# Altium schematic sheet Gastroscopy-CutController_MCU.SchDoc: MCU
size 279 x 215 mm; Date: not used; ApprovedBy: not used; CheckedBy: not used; Author: not used; DrawnBy: not used; Organization: not used; Address4: not used; SheetNumber: 6; SheetTotal: 8; Time: not used; ImagePath: not used; Application_BuildNumber: not used
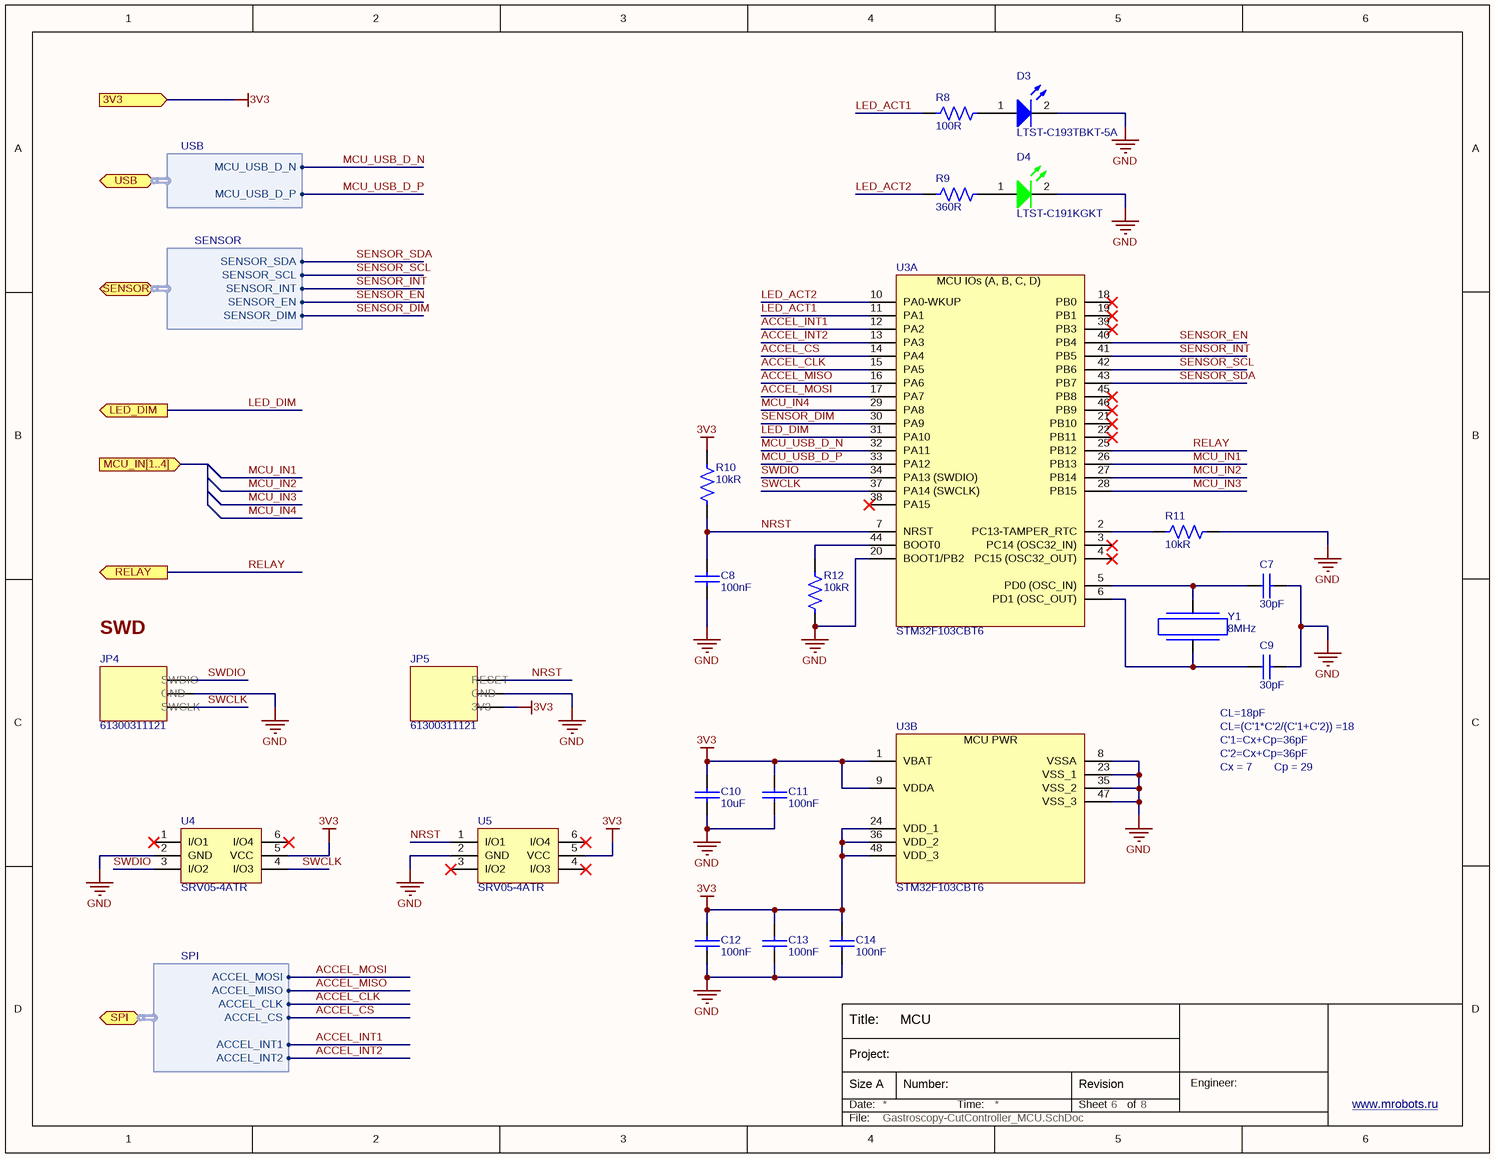
[diagram p0: Gastroscopy-CutController_MCU.SchDoc]

## Parts
C7  30pF  [CAP_0603]
C8  100nF  [CAP_0603]
C9  30pF  [CAP_0603]
C10  10uF  [CAP_0805]
C11  100nF  [CAP_0603]
C12  100nF  [CAP_0603]
C13  100nF  [CAP_0603]
C14  100nF  [CAP_0603]
D3  LTST-C193TBKT-5A  [L_0603_BLUE]
D4  LTST-C191KGKT  [L_0603_GREEN]
JP4  61300311121  [61300311121]
JP5  61300311121  [61300311121]
R8  100R  [RES_0603]
R9  360R  [RES_0603]
R10  10kR  [RES_0603]
R11  10kR  [RES_0603]
R12  10kR  [RES_0603]
U3  STM32F103CBT6  [LQFP48]  (parts A,B of 2)
U4  SRV05-4ATR  [SOT-23-6]
U5  SRV05-4ATR  [SOT-23-6]
Y1  8MHz  [HC-49/US]

## Ports
3V3 (in), LED_DIM (out), MCU_IN[1..4] (in), RELAY (out), SENSOR (bidir, harness SENSOR), SPI (bidir, harness SPI), USB (bidir, harness USB)

## Harnesses
USB: MCU_USB_D_N, MCU_USB_D_P
SENSOR: SENSOR_SDA, SENSOR_SCL, SENSOR_INT, SENSOR_EN, SENSOR_DIM
SPI: ACCEL_MOSI, ACCEL_MISO, ACCEL_CLK, ACCEL_INT1, ACCEL_CS, ACCEL_INT2

## Nets
3V3: C10.2 C11.1 C12.1 C13.1 C14.1 JP5.3 R10.1 U3.1(VBAT) U3.9(VDDA) U3.24(VDD_1) U3.36(VDD_2) U3.48(VDD_3) U4.5(VCC) U5.5(VCC) ; port 3V3
GND: C7.2 C8.2 C9.2 C10.1 C11.2 C12.2 C13.2 C14.2 D3.2(K) D4.2(K) JP4.2 JP5.2 R11.1 R12.1 U3.8(VSSA) U3.20(BOOT1/PB2) U3.23(VSS_1) U3.35(VSS_2) U3.47(VSS_3) U4.2(GND) U5.2(GND)
ACCEL_CLK: U3.15(PA5) ; port SPI.ACCEL_CLK
ACCEL_CS: U3.14(PA4) ; port SPI.ACCEL_CS
ACCEL_INT1: U3.12(PA2) ; port SPI.ACCEL_INT1
ACCEL_INT2: U3.13(PA3) ; port SPI.ACCEL_INT2
ACCEL_MISO: U3.16(PA6) ; port SPI.ACCEL_MISO
ACCEL_MOSI: U3.17(PA7) ; port SPI.ACCEL_MOSI
LED_ACT1: R8.1 U3.11(PA1)
LED_ACT2: R9.1 U3.10(PA0-WKUP)
LED_DIM: U3.31(PA10) ; port LED_DIM
MCU_IN1: U3.26(PB13)
MCU_IN2: U3.27(PB14)
MCU_IN3: U3.28(PB15)
MCU_IN4: U3.29(PA8)
MCU_USB_D_N: U3.32(PA11) ; port USB.MCU_USB_D_N
MCU_USB_D_P: U3.33(PA12) ; port USB.MCU_USB_D_P
NRST: C8.1 JP5.1 R10.2 U3.7(NRST) U5.1(I/O1)
RELAY: U3.25(PB12) ; port RELAY
SENSOR_DIM: U3.30(PA9) ; port SENSOR.SENSOR_DIM
SENSOR_EN: U3.40(PB4) ; port SENSOR.SENSOR_EN
SENSOR_INT: U3.41(PB5) ; port SENSOR.SENSOR_INT
SENSOR_SCL: U3.42(PB6) ; port SENSOR.SENSOR_SCL
SENSOR_SDA: U3.43(PB7) ; port SENSOR.SENSOR_SDA
SWCLK: JP4.3 U3.37(PA14_(SWCLK)) U4.4(I/O3)
SWDIO: JP4.1 U3.34(PA13_(SWDIO)) U4.3(I/O2)
NetC7_1: C7.1 U3.5(PD0_(OSC_IN)) Y1.2
NetC9_1: C9.1 U3.6(PD1_(OSC_OUT)) Y1.1
NetD3_1: D3.1(A) R8.2
NetD4_1: D4.1(A) R9.2
NetR11_2: R11.2 U3.2(PC13-TAMPER_RTC)
NetR12_2: R12.2 U3.44(BOOT0)

Not connected (* = marked no-connect by the designer): U3 3(PC14_(OSC32_IN))* 4(PC15_(OSC32_OUT))* 18(PB0)* 19(PB1)* 21(PB10)* 22(PB11)* 38(PA15)* 39(PB3)* 45(PB8)* 46(PB9)*; U4 1(I/O1)* 6(I/O4)*; U5 3(I/O2)* 4(I/O3)* 6(I/O4)*

## Notes on the sheet
- SWD
- (near C9) CL=18pF
- CL=(C'1*C'2/(C'1+C'2)) =18
- Cx = 7
- C'1=Cx+Cp=36pF
- C'2=Cx+Cp=36pF
- Cp = 29
- Title:
- Date:
- Size A
- Project:
- Number:
- Time:
- Sheet
- Revision
- of
- Engineer:
- www.mrobots.ru <http://mrobots.ru/>
- File:
- (in symbol STM32F103CBT6, part A) MCU IOs (A, B, C, D)
- (in symbol STM32F103CBT6, part B) MCU PWR

## Library data of the parts
C7 C9 = CC0603JRNPO9BN300: CAP CER 30PF 50V NPO 0603; Manufacturer: Yageo; Tolerance: 5%; Dielectric: C0G; Dissipation Factor: 0.1%; Insulation Resistance: 10GR; Supplier 1: Arrow Electronics; Manufacturer Part Number: CC0603JRNPO9BN300; RoHS: Yes; Category: Ceramic Capacitors; Stock 1: 24000; Pricing 1: 4000=0,01130, 8000=0,00940, 12000=0,00820, 40000=0,00780 (USD); Mount: Surface Mount; Case/Package: 0603; Number of Pins: 2; Case Code (Imperial): 0603; Case Code (Metric): 1608; Weight: 7.1E-05oz; Min Operating Temperature: -55°C; Max Operating Temperature: 125°C; Capacitance: 30pF; Voltage Rating: 50V; Packaging: Tape and Reel; Voltage Rating (DC): 50V; Termination: SMD/SMT; Resistor Type: Ceramic; Series: CC; Construction: Flat; Length: 1.6mm; Width: 0.8mm; Height: 0.8mm; Thickness: 0.035inch; Depth: 0.8mm; Radiation Hardening: No; Reach SVHC Compliant: Yes; Lead Free: Lead Free; RoHS Compliant: Yes; ComponentLink1URL: https://datasheet.ciiva.com/26862/getdatasheetpartid-403531-26862766.pdf?src-supplier=Verical; ComponentLink1Description: https://datasheet.ciiva.com/26862/getdatasheetpartid-403531-26862766.pdf?src-supplier=Verical; ComponentLink2URL: https://datasheet.ciiva.com/7978/1132289-7978140.pdf?src-supplier=Element14; ComponentLink2Description: https://datasheet.ciiva.com/7978/1132289-7978140.pdf?src-supplier=Element14; ComponentLink3URL: https://datasheet.ciiva.com/28450/1443161-28450494.pdf?src-supplier=Element14; ComponentLink3Description: https://datasheet.ciiva.com/28450/1443161-28450494.pdf?src-supplier=Element14; ComponentLink4URL: https://datasheet.ciiva.com/13264/upy-gp-np0-16v-to-50v-8-3714-13264406.pdf?src-supplier=Mouser; ComponentLink4Description: https://datasheet.ciiva.com/13264/upy-gp-np0-16v-to-50v-8-3714-13264406.pdf?src-supplier=Mouser; Supplier Part Number 1: CC0603JRNPO9BN300
C8 C11-C14 = CL10B104KB8NNNL: CAP CER 0.1UF 50V X7R 0603; Manufacturer 1: Samsung; Tolerance: 10%; Supplier 1: Digi-Key; Manufacturer Part Number 1: CL10B104KB8NNNL; RoHS: Yes; Category: Ceramic Capacitors; Stock 1: 2348404; Pricing 1: 15000=0,00532, 30000=0,00506 (USD); Mount: Surface Mount; Case/Package: 0603; Min Operating Temperature: -55°C; Max Operating Temperature: 125°C; Capacitance: 100nF; Packaging: Tape and Reel; Package Quantity: 15000; Voltage Rating: 50V; Dielectric: X7R; Voltage Rating (DC): 50V; Series: CL; Construction: Flat; Length: 1.6mm; Width: 0.031inch; Height: 0.8mm; Thickness: 0.035inch; Depth: 0.8mm; Radiation Hardening: No; RoHS Compliant: Yes; ComponentLink1URL: https://datasheet.ciiva.com/26838/getdatasheetpartid-357523-26838415.pdf?src-supplier=Verical; ComponentLink1Description: https://datasheet.ciiva.com/26838/getdatasheetpartid-357523-26838415.pdf?src-supplier=Verical; ComponentLink2URL: https://datasheet.ciiva.com/25741/cl10b104kb8nnnl-25741341.pdf?src-supplier=Digi-Key; ComponentLink2Description: https://datasheet.ciiva.com/25741/cl10b104kb8nnnl-25741341.pdf?src-supplier=Digi-Key; Supplier Part Number 1: 1276-CL10B104KB8NNNLTR-ND
C10 = CL21B106KOQNNNE: CAP CER 10UF 16V X7R 0805; Manufacturer 1: Samsung; Tolerance: 10%; Supplier 1: Avnet; Manufacturer Part Number 1: CL21B106KOQNNNE; RoHS: Yes; Category: Ceramic Capacitors; Stock 1: 1089000; Pricing 1: 2000=0,02892, 4000=0,02851, 8000=0,02768, 12000=0,02707, 16000=0,02603 (USD); Mount: Surface Mount; Case/Package: 0805; Case Code (Metric): 2012; Case Code (Imperial): 0805; Contact Plating: Tin; Min Operating Temperature: -55°C; Max Operating Temperature: 125°C; Packaging: Tape and Reel; Capacitance: 10uF; Voltage Rating: 16V; Package Quantity: 1; Dielectric: X7R; Series: CL; Construction: Flat; Voltage: 16V; Length: 2mm; Width: 0.049inch; Height: 1.25mm; Thickness: 0.055inch; Depth: 1.25mm; Radiation Hardening: No; RoHS Compliant: Yes; ComponentLink1URL: https://datasheet.ciiva.com/25794/cl21b106koqnnne-25794472.pdf?src-supplier=Digi-Key; ComponentLink1Description: https://datasheet.ciiva.com/25794/cl21b106koqnnne-25794472.pdf?src-supplier=Digi-Key; ComponentLink2URL: https://datasheet.ciiva.com/16428/cl21b106koqnnne-16428887.pdf?src-supplier=Future+Electronics; ComponentLink2Description: https://datasheet.ciiva.com/16428/cl21b106koqnnne-16428887.pdf?src-supplier=Future+Electronics; ComponentLink3URL: https://datasheet.ciiva.com/26920/getdatasheetpartid-355170-26920201.pdf?src-supplier=Verical; ComponentLink3Description: https://datasheet.ciiva.com/26920/getdatasheetpartid-355170-26920201.pdf?src-supplier=Verical; Supplier Part Number 1: CL21B106KOQNNNE
D3 = LTST-C193TBKT-5A: LED BLUE CLEAR CHIP SMD; Manufacturer 1: Vishay Lite-On; Lens Color: Colorless; Forward Current: 20mA; Forward Voltage: 2.8V; Luminous Intensity: 15mcd; Viewing Angle: 130°; Lens Style: Diffused,Colorless,Rectangular,Clear; Dominant Wavelength: 475nm; Test Current: 5mA; Number of Elements: 1; Power Dissipation: 76mW; Reverse Voltage: 5V; Supplier 1: Arrow Electronics; RoHS: Yes; Category: LEDs; Stock 1: 226; Pricing 1: 1=0.33280, 10=0.16780, 25=0.16610 (USD); Mount: Surface Mount; Case/Package: 0603; Number of Pins: 2; Color: Blue; Case Code (Metric): 1608; Case Code (Imperial): 0603; Min Operating Temperature: -20°C; Max Operating Temperature: 80°C; Illumination Color: Blue; Packaging: Tape and Reel; Package Quantity: 1; Lens Transparency: Clear; Number of LEDs: 1; Length: 1.6mm; Width: 0.8mm; Height: 0.35mm; Depth: 0.8mm; Radiation Hardening: No; RoHS Compliant: Yes; Lead Free: Lead Free; ComponentLink1URL: https://datasheet.ciiva.com/2111/ltst-c193tbkt-5a-2111219.pdf?src-supplier=Digi-Key; ComponentLink1Description: https://datasheet.ciiva.com/2111/ltst-c193tbkt-5a-2111219.pdf?src-supplier=Digi-Key; ComponentLink2URL: https://datasheet.ciiva.com/11773/0900766b80dc0554-11773880.pdf?src-supplier=RSComponents; ComponentLink2Description: https://datasheet.ciiva.com/11773/0900766b80dc0554-11773880.pdf?src-supplier=RSComponents; ComponentLink3URL: https://datasheet.ciiva.com/4688/lite-on-ltst-c193tbkt-5a-187386-4688832.pdf?src-supplier=Mouser; ComponentLink3Description: https://datasheet.ciiva.com/4688/lite-on-ltst-c193tbkt-5a-187386-4688832.pdf?src-supplier=Mouser; ComponentLink4URL: https://datasheet.ciiva.com/16210/ltst-c193tbkt-5a-16210824.pdf?src-supplier=Future+Electronics; ComponentLink4Description: https://datasheet.ciiva.com/16210/ltst-c193tbkt-5a-16210824.pdf?src-supplier=Future+Electronics; ComponentLink5URL: https://datasheet.ciiva.com/15201/getdatasheetpartid-293056-15201395.pdf?src-supplier=Verical; ComponentLink5Description: https://datasheet.ciiva.com/15201/getdatasheetpartid-293056-15201395.pdf?src-supplier=Verical; ComponentLink6URL: https://datasheet.ciiva.com/2111/p-100-ltst-c193tbkt-5a-2111220.pdf?src-supplier=Digi-Key; ComponentLink6Description: https://datasheet.ciiva.com/2111/p-100-ltst-c193tbkt-5a-2111220.pdf?src-supplier=Digi-Key; ComponentLink7URL: https://datasheet.ciiva.com/2111/p-100-ltst-c193tbkt-5a-2111221.pdf?src-supplier=Digi-Key; ComponentLink7Description: https://datasheet.ciiva.com/2111/p-100-ltst-c193tbkt-5a-2111221.pdf?src-supplier=Digi-Key; Supplier Part Number 1: LTST-C193TBKT-5A; Manufacturer Part Number 1: LTST-C193TBKT-5A
D4 = LTST-C191KGKT: LED GREEN CLEAR SMD; Manufacturer 1: Vishay Lite-On; Lens Color: Colorless; Luminous Intensity: 35mcd; Viewing Angle: 130°; Forward Voltage: 2V; Dominant Wavelength: 571nm; Test Current: 20mA; Wavelength: 574nm; Lens Style: Rectangular,Colorless; Forward Current: 30mA; Number of Elements: 1; Power Dissipation: 75mW; Reverse Voltage: 5V; Supplier 1: Arrow Electronics; RoHS: Yes; Category: LEDs; Stock 1: 10000; Pricing 1: 5000=0.04240, 10000=0.03360, 25000=0.02880, 50000=0.02750 (USD); Mount: Surface Mount; Case/Package: 0603; Number of Pins: 2; Color: Green; Case Code (Metric): 1608; Case Code (Imperial): 0603; Min Operating Temperature: -55°C; Max Operating Temperature: 85°C; Packaging: Tape and Reel; Package Quantity: 1; Lens Transparency: Clear; Illumination Color: Green; Number of LEDs: 1; Power Rating: 75mW; Max Power Dissipation: 75mW; Length: 1.6mm; Width: 0.8mm; Height: 0.55mm; Depth: 0.8mm; Radiation Hardening: No; RoHS Compliant: Yes; Lead Free: Lead Free; ComponentLink1URL: https://datasheet.ciiva.com/2109/ltst-c191kgkt-2109973.pdf?src-supplier=Digi-Key; ComponentLink1Description: https://datasheet.ciiva.com/2109/ltst-c191kgkt-2109973.pdf?src-supplier=Digi-Key; Supplier Part Number 1: LTST-C191KGKT; Manufacturer Part Number 1: LTST-C191KGKT
JP4 = 61300311121: CONN HEADER 3 POS 2.54; Manufacturer 1: Wurth Electronics; Contact_1: SWDIO; Contact_2: GND; Contact_3: SWCLK; Number of Positions: 3; Gender: Male; Connector Type: Male Pin; Pitch: 0.1inch; ComponentLink1URL: http://www.mouser.com/ds/2/445/6130xx11121-538006.pdf?src-supplier=Mouser; ComponentLink1Description: http://www.mouser.com/ds/2/445/6130xx11121-538006.pdf?src-supplier=Mouser; ComponentLink2URL: http://www.farnell.com/cad/1737268.pdf?src-supplier=Element14; ComponentLink2Description: http://www.farnell.com/cad/1737268.pdf?src-supplier=Element14; ComponentLink3URL: https://katalog.we-online.de/em/datasheet/6130xx11121.pdf?src-supplier=Digi-Key; ComponentLink3Description: https://katalog.we-online.de/em/datasheet/6130xx11121.pdf?src-supplier=Digi-Key; Supplier 1: Digi-Key; Manufacturer Part Number 1: 61300311121; RoHS: Yes; Category: Connectors; Stock 1: 199897; Pricing 1: 1=0,13000, 10=0,11300, 25=0,09400, 50=0,07900, 100=0,07100, 1000=0,06600 (USD); Mount: Through Hole; Contact Plating: Gold; Contact Material: Copper; Color: Black; Number of Rows: 1; Packaging: Bulk; Termination: Solder; Number of Contacts: 3; Series: WR-PHD; Contact Type: Male Pin; Contact Mating Length: 0.236inch; Lead Free: Lead Free; RoHS Compliant: Yes; Supplier Part Number 1: 732-5316-ND
JP5 = 61300311121: CONN HEADER 3 POS 2.54; Manufacturer 1: Wurth Electronics; Contact_1: RESET; Contact_2: GND; Contact_3: 3V3; Number of Positions: 3; Gender: Male; Connector Type: Male Pin; Pitch: 0.1inch; ComponentLink1URL: http://www.mouser.com/ds/2/445/6130xx11121-538006.pdf?src-supplier=Mouser; ComponentLink1Description: http://www.mouser.com/ds/2/445/6130xx11121-538006.pdf?src-supplier=Mouser; ComponentLink2URL: http://www.farnell.com/cad/1737268.pdf?src-supplier=Element14; ComponentLink2Description: http://www.farnell.com/cad/1737268.pdf?src-supplier=Element14; ComponentLink3URL: https://katalog.we-online.de/em/datasheet/6130xx11121.pdf?src-supplier=Digi-Key; ComponentLink3Description: https://katalog.we-online.de/em/datasheet/6130xx11121.pdf?src-supplier=Digi-Key; Supplier 1: Digi-Key; Manufacturer Part Number 1: 61300311121; RoHS: Yes; Category: Connectors; Stock 1: 199897; Pricing 1: 1=0,13000, 10=0,11300, 25=0,09400, 50=0,07900, 100=0,07100, 1000=0,06600 (USD); Mount: Through Hole; Contact Plating: Gold; Contact Material: Copper; Color: Black; Number of Rows: 1; Packaging: Bulk; Termination: Solder; Number of Contacts: 3; Series: WR-PHD; Contact Type: Male Pin; Contact Mating Length: 0.236inch; Lead Free: Lead Free; RoHS Compliant: Yes; Supplier Part Number 1: 732-5316-ND
R8 = RC0603FR-07100RL: RES 100 OHM 1% 1/10W 0603; Manufacturer 1: Yageo; Voltage Rating (DC): 50V; Temperature Coefficient: 100ppm/°C; Power Rating: 100mW; Supplier 1: Arrow Electronics; RoHS: Yes; Category: Chip SMD Resistors; Stock 1: 17580000; Pricing 1: 5000=0,00180 (USD); Case/Package: 0603; Number of Pins: 2; Case Code (Imperial): 0603; Case Code (Metric): 1608; Size Code: 0603; Min Operating Temperature: -55°C; Max Operating Temperature: 155°C; Resistance: 100R; Tolerance: 1%; Packaging: Tape and Reel; Resistor Type: Thick Film; Voltage Rating: 50V; Termination: SMD/SMT; Features: Moisture Resistant; Series: RC; Max Power Dissipation: 100mW; Number of Terminations: 2; Construction: Rectangular; Resistance Tolerance: 1%; Technology: THICK FILM; Length: 1.6mm; Width: 0.8mm; Height: 0.45mm; Depth: 0.8mm; REACH SVHC: Unknown; Lead Free: Lead Free; Military Standard: Not; RoHS Compliant: Yes; Supplier Part Number 1: RC0603FR-07100RL; Manufacturer Part Number 1: RC0603FR-07100RL
R9 = RC0603FR-07360RL: RES 360 OHM 1% 1/10W 0603; Manufacturer 1: Yageo; Power Rating: 100mW; Voltage Rating: 50V; Temperature Coefficient: 100ppm/°C; Supplier 1: Arrow Electronics; Manufacturer Part Number 1: RC0603FR-07360RL; RoHS: Yes; Category: Chip SMD Resistors; Stock 1: 7884; Pricing 1: 1=0,05320, 10=0,01120, 100=0,00760, 250=0,00660, 1000=0,00380, 3000=0,00370, 6000=0,00230 (USD); Case/Package: 0603; Case Code (Metric): 1608; Case Code (Imperial): 0603; Size Code: 0603; Min Operating Temperature: -55°C; Max Operating Temperature: 155°C; Packaging: Tape and Reel; Resistance: 360R; Tolerance: 1%; Package Quantity: 1; Resistor Type: Thick Film; Number of Terminations: 2; Termination: SMD/SMT; Max Power Dissipation: 100mW; Voltage Rating (DC): 50V; Features: Moisture Resistant; Series: RC; Construction: Rectangular; Length: 1.6mm; Width: 0.031inch; Height: 0.022inch; Depth: 0.8mm; Military Standard: Not; Lead Free: Lead Free; RoHS Compliant: Yes; ComponentLink1URL: https://datasheet.ciiva.com/2454/pyu-r-int-thick-7-2454271.pdf?src-supplier=Digi-Key; ComponentLink1Description: https://datasheet.ciiva.com/2454/pyu-r-int-thick-7-2454271.pdf?src-supplier=Digi-Key; ComponentLink2URL: https://datasheet.ciiva.com/2454/pyu-r-int-thick-7-2454272.pdf?src-supplier=Digi-Key; ComponentLink2Description: https://datasheet.ciiva.com/2454/pyu-r-int-thick-7-2454272.pdf?src-supplier=Digi-Key; ComponentLink3URL: https://datasheet.ciiva.com/2454/pyu-r-int-thick-7-2454270.pdf?src-supplier=Digi-Key; ComponentLink3Description: https://datasheet.ciiva.com/2454/pyu-r-int-thick-7-2454270.pdf?src-supplier=Digi-Key; ComponentLink4URL: https://datasheet.ciiva.com/12558/rc0603-272842-12558645.pdf?src-supplier=Mouser; ComponentLink4Description: https://datasheet.ciiva.com/12558/rc0603-272842-12558645.pdf?src-supplier=Mouser; Supplier Part Number 1: RC0603FR-07360RL
R10-R12 = RC0603FR-0710KL: RES 10K OHM 1% 1/10W 0603; Manufacturer 1: Yageo; Voltage Rating (DC): 50V; Temperature Coefficient: 100ppm/°C; Power Rating: 100mW; Voltage Rating: 75V; Supplier 1: Arrow Electronics; RoHS: Yes; Category: Chip SMD Resistors; Stock 1: 4950000; Pricing 1: 5000=0,00240 (USD); Case/Package: 0603; Number of Pins: 2; Case Code (Imperial): 0603; Case Code (Metric): 1608; Weight: 7.1E-05oz; Size Code: 0603; Min Operating Temperature: -55°C; Max Operating Temperature: 155°C; Packaging: Tape and Reel; Resistance: 10kR; Tolerance: 1%; Resistor Type: Thick Film; Termination: SMD/SMT; Features: Moisture Resistant; Series: RC; Max Power Dissipation: 100mW; Number of Terminations: 2; Resistance Tolerance: 1%; Construction: Rectangular; Length: 1.6mm; Width: 0.8mm; Height: 0.45mm; Depth: 0.8mm; Lead Pitch: 0.3mm; REACH SVHC: Unknown; Lead Free: Lead Free; Military Standard: Not; RoHS Compliant: Yes; ComponentLink1URL: https://datasheet.ciiva.com/7660/38590-7660789.pdf?src-supplier=Element14; ComponentLink1Description: https://datasheet.ciiva.com/7660/38590-7660789.pdf?src-supplier=Element14; ComponentLink2URL: https://datasheet.ciiva.com/7983/443971-7983596.pdf?src-supplier=Element14; ComponentLink2Description: https://datasheet.ciiva.com/7983/443971-7983596.pdf?src-supplier=Element14; ComponentLink3URL: https://datasheet.ciiva.com/22747/443971-22747519.pdf?src-supplier=Element14; ComponentLink3Description: https://datasheet.ciiva.com/22747/443971-22747519.pdf?src-supplier=Element14; ComponentLink4URL: https://datasheet.ciiva.com/46440/1868787-46440891.pdf?src-supplier=Element14; ComponentLink4Description: https://datasheet.ciiva.com/46440/1868787-46440891.pdf?src-supplier=Element14; ComponentLink5URL: https://datasheet.ciiva.com/7746/1738695-7746239.pdf?src-supplier=Element14; ComponentLink5Description: https://datasheet.ciiva.com/7746/1738695-7746239.pdf?src-supplier=Element14; Supplier Part Number 1: RC0603FR-0710KL; Manufacturer Part Number 1: RC0603FR-0710KL
U3 = STM32F103CBT6: IC MCU 32BIT 128KB FLASH 48LQFP; Manufacturer 1: STMicroelectronics; RAM Size: 20KB; Max Power Dissipation: 363mW; Interface: I2C,SPI,USB,CAN,IrDA,UART,USART,LIN; Number of I/Os: 37; Number of Timers/Counters: 4; Max Supply Voltage: 3.6V; Frequency: 72MHz; Min Supply Voltage: 2V; Oscillator Type: Internal; Data Bus Width: 32b; Watchdog Timer: Yes; Peripherals: POR,PWM,WDT,DMA,Temp Sensor,I2C; Core Architecture: ARM; Number of PWM Channels: 12; Number of ADC Channels: 10; Number of Bits: 32; Number of SPI Channels: 2; Supplier 1: Future Electronics; Manufacturer Part Number 1: STM32F103CBT6; RoHS: Yes; Category: Microcontrollers; Pricing 1: 250=8,08000 (USD); Case/Package: LQFP; Number of Pins: 48; Contact Plating: Gold; Min Operating Temperature: -40°C; Max Operating Temperature: 85°C; Package Quantity: 250; Packaging: Tray; Number of Programmable I/O: 37; Max Frequency: 72MHz; Memory Type: FLASH; Memory Size: 128KB; Series: STM32 F1; Density: 128KB; Number of I2C Channels: 2; Address Bus Width: 32b; Termination: SMD/SMT; Length: 7mm; Width: 7.2mm; Height: 1.45mm; Radiation Hardening: No; Reach SVHC Compliant: Yes; Lead Free: Lead Free; RoHS Compliant: Yes; ComponentLink1URL: https://datasheet.ciiva.com/23669/1714663-23669200.pdf?src-supplier=Newark; ComponentLink1Description: https://datasheet.ciiva.com/23669/1714663-23669200.pdf?src-supplier=Newark; ComponentLink2URL: https://datasheet.ciiva.com/15122/getdatasheetpartid-92132-15122195.pdf?src-supplier=Verical; ComponentLink2Description: https://datasheet.ciiva.com/15122/getdatasheetpartid-92132-15122195.pdf?src-supplier=Verical; ComponentLink3URL: https://datasheet.ciiva.com/5752/cd00161566-5752838.pdf?src-supplier=Farnell; ComponentLink3Description: https://datasheet.ciiva.com/5752/cd00161566-5752838.pdf?src-supplier=Farnell; ComponentLink4URL: https://datasheet.ciiva.com/14100/pustm-arm-microcont-stm32f103-en-14100509.pdf?src-supplier=Distrelec; ComponentLink4Description: https://datasheet.ciiva.com/14100/pustm-arm-microcont-stm32f103-en-14100509.pdf?src-supplier=Distrelec; ComponentLink5URL: https://datasheet.ciiva.com/1502/cd00161566-1502328.pdf?src-supplier=Digi-Key; ComponentLink5Description: https://datasheet.ciiva.com/1502/cd00161566-1502328.pdf?src-supplier=Digi-Key; ComponentLink6URL: https://datasheet.ciiva.com/4840/cd00161566-4840398.pdf?src-supplier=Mouser; ComponentLink6Description: https://datasheet.ciiva.com/4840/cd00161566-4840398.pdf?src-supplier=Mouser; ComponentLink7URL: https://datasheet.ciiva.com/16219/cd00161566-16219150.pdf?src-supplier=Future+Electronics; ComponentLink7Description: https://datasheet.ciiva.com/16219/cd00161566-16219150.pdf?src-supplier=Future+Electronics; Supplier Part Number 1: 1104749
U4 U5 = SRV05-4ATR: TVS DIODE 5VWM 17.5VC SOT23-6; Manufacturer 1: Sangdest Microelectronics; Supplier 1: Digi-Key; Manufacturer Part Number 1: SRV05-4ATR; RoHS: No; Category: TVS Diodes; Stock 1: 31500; Pricing 1: 1=0,45000, 10=0,36700, 100=0,24990, 500=0,18744, 1000=0,14058 (USD); Supplier Part Number 1: 1655-1653-1-ND
Y1 = ATS080B-E: CRYSTAL 8.0000MHZ 18PF TH; Manufacturer 1: CTS; Frequency Tolerance: 30ppm; ESR (Equivalent Series Resistance): 60R; Frequency Stability: 50ppm; Supplier 1: Avnet; RoHS: Yes; Category: Crystals; Stock 1: 4510; Pricing 1: 1000=0.18120, 1200=0.17880, 2200=0.17040, 5000=0.13800, 10000=0.12150, 50000=0.10956, 100000=0.10707 (USD); Mount: Through Hole; Number of Pins: 2; Contact Plating: Copper,Tin,Silver; Min Operating Temperature: -40°C; Max Operating Temperature: 85°C; Package Quantity: 100; Frequency: 8MHz; Load Capacitance: 18pF; Packaging: Bulk; Tolerance: 30ppm; Termination: Radial; Series: ATS; Length: 0.427inch; Width: 0.177inch; Height: 0.145inch; RoHS Compliant: Yes; ComponentLink1URL: https://datasheet.ciiva.com/859/008-0309-0-859649.pdf?src-supplier=Digi-Key; ComponentLink1Description: https://datasheet.ciiva.com/859/008-0309-0-859649.pdf?src-supplier=Digi-Key; ComponentLink2URL: https://datasheet.ciiva.com/3176/008-0309-0-3176342.pdf?src-supplier=Avnet; ComponentLink2Description: https://datasheet.ciiva.com/3176/008-0309-0-3176342.pdf?src-supplier=Avnet; ComponentLink3URL: https://datasheet.ciiva.com/4945/008-0309-0-32667-4945355.pdf?src-supplier=Mouser; ComponentLink3Description: https://datasheet.ciiva.com/4945/008-0309-0-32667-4945355.pdf?src-supplier=Mouser; Supplier Part Number 1: ATS080B-E; Manufacturer Part Number 1: ATS080B-E